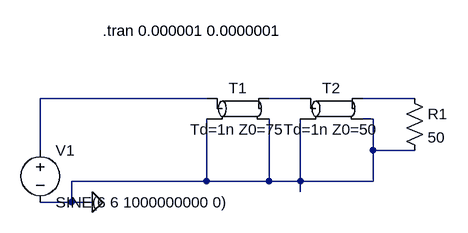
[diagram p0: schematic Draft48.asc]
Draft48.asc, the LTspice schematic file:
Version 4
SHEET 1 880 680
WIRE 400 160 144 160
WIRE 544 160 496 160
WIRE 720 160 640 160
WIRE 656 192 640 192
WIRE 144 240 144 160
WIRE 656 240 656 192
WIRE 720 240 656 240
WIRE 400 288 400 192
WIRE 400 288 192 288
WIRE 496 288 496 192
WIRE 496 288 400 288
WIRE 544 288 544 192
WIRE 544 288 496 288
WIRE 656 288 656 240
WIRE 656 288 544 288
WIRE 544 304 544 288
WIRE 192 320 192 288
WIRE 192 320 144 320
WIRE 224 320 192 320
FLAG 224 320 0
SYMBOL voltage 144 224 R0
SYMATTR InstName V1
SYMATTR Value SINE(6 6 1000000000 0)
SYMBOL tline 448 176 R0
SYMATTR InstName T1
SYMATTR Value Td=1n Z0=75
SYMBOL res 704 144 R0
SYMATTR InstName R1
SYMATTR Value 50
SYMBOL tline 592 176 R0
SYMATTR InstName T2
SYMATTR Value Td=1n Z0=50
TEXT 240 56 Left 2 !.tran 0.000001 0.0000001

The netlist it stands for:
* Draft48.asc
V1 N001 0 SINE(6 6 1000000000 0)
T1 N001 0 N002 0 Td=1n Z0=75
R1 N003 0 50
T2 N002 0 N003 0 Td=1n Z0=50
.tran 0.000001 0.0000001
.backanno
.end